# Altium schematic sheet levelshift6x.SchDoc
size A
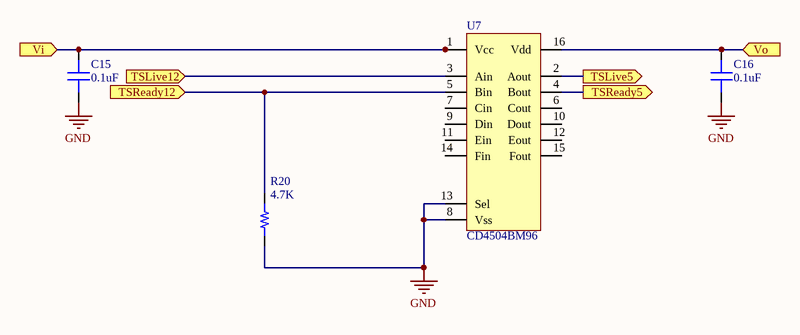
[diagram p0: levelshift6x.SchDoc]

## Parts
C15  capacitance: 0.1uF  [0603]  (hidden comment: capacitor)
C16  capacitance: 0.1uF  [0603]  (hidden comment: capacitor)
R20  4.7K  [RES 0603/1608]
U7  CD4504BM96  [SOIC-16]

## Ports
TSLive5 (out), TSLive12 (in), TSReady5 (out), TSReady12 (in), Vi (in), Vo (in)

## Nets
GND: C15.1 C16.1 R20.1 U7.8(Vss) U7.13(Sel)
TSLive5: U7.2(Aout) ; port TSLive5
TSLive12: U7.3(Ain) ; port TSLive12
TSReady5: U7.4(Bout) ; port TSReady5
TSReady12: R20.2 U7.5(Bin) ; port TSReady12
Vi: C15.2 U7.1(Vcc) ; port Vi
Vo: C16.2 U7.16(Vdd) ; port Vo

Not connected (* = marked no-connect by the designer): U7 6(Cout) 7(Cin) 9(Din) 10(Dout) 11(Ein) 12(Eout) 14(Fin) 15(Fout)

## Library data of the parts
C15 C16 = 1: Generic 0603 capacitor; id: 1; voltage: 50; dielectric: Ceramic; percent tolerance: 10; name: 0603 Capacitor; ESR: 1; package: 0603; quantity: 0
R20 = 1: id: 1; name: 0603 Resistor; percent tolerance: 5; resistance: 4.7K; package: 0603; quantity: 0
U7 = 1: Voltage Level Translator Unidirectional 1 Cir; id: 1; vcc: 20; name: CD4504BM96; type: Level shifter CMOS-CMOS; package: SOIC-16; quantity: 0; link: https://www.digikey.com/product-detail/en/texas-instruments/CD4504BM96/296-14150-2-ND/525968